# EAGLE design tracking_system (EAGLE 9.6.2)
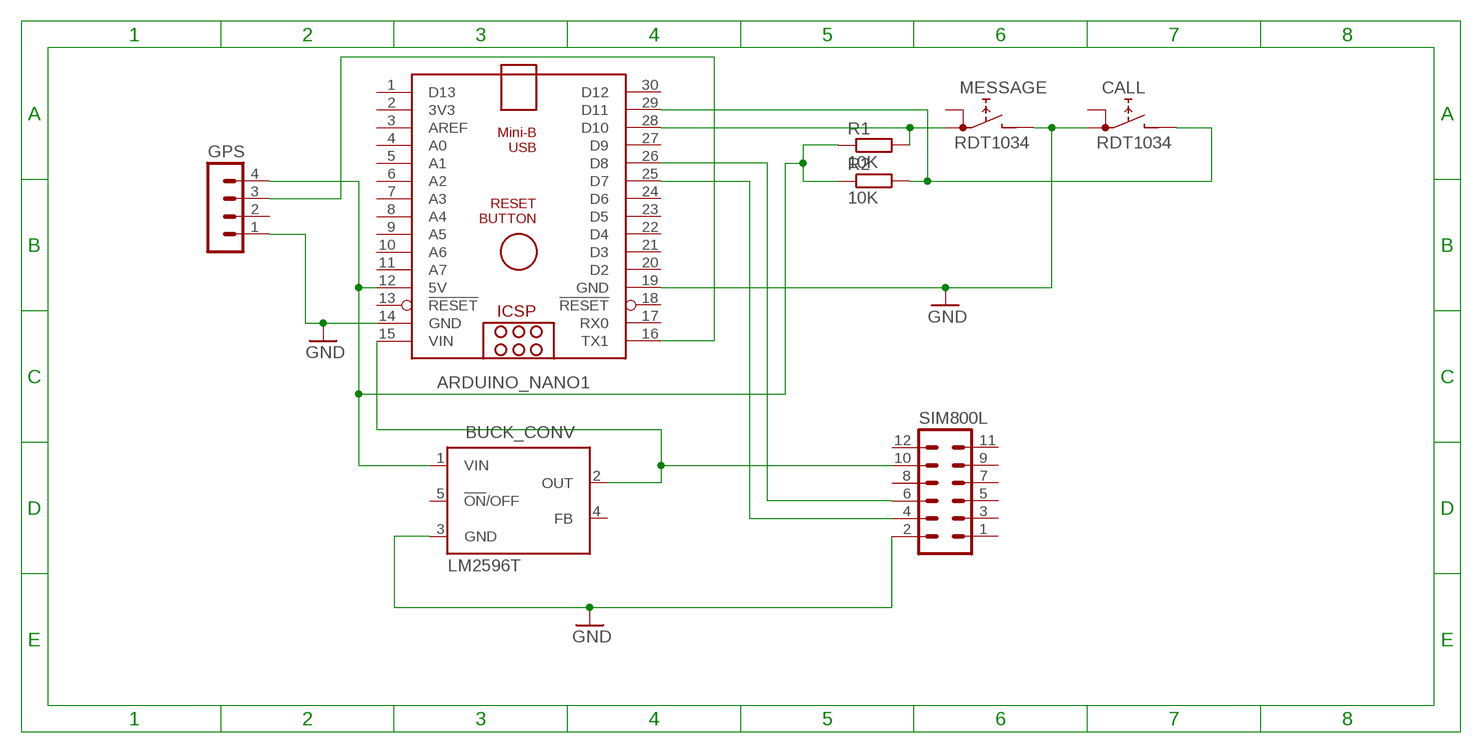
[diagram p0: schematic, sheet 1]

## Parts
ARDUINO_NANO1  ARDUINO_NANO  [ARDUINO_NANO]
BUCK_CONV  LM2596T  [T05D]
CALL  RDT1034  [RDT1034]
GPS  MA04-1  [MA04-1]
MESSAGE  RDT1034  [RDT1034]
R1  10K  R-EU_0207/10  [0207/10]
R2  10K  R-EU_0207/10  [0207/10]
SIM800L  MA06-2  [MA06-2]

## Nets
GND: ARDUINO_NANO1.14(GND) ARDUINO_NANO1.19(GND) BUCK_CONV.3(GND) CALL.A1 GPS.1 MESSAGE.B SIM800L.2
N$2: ARDUINO_NANO1.16(TX1) GPS.3
N$3: ARDUINO_NANO1.12(5V) BUCK_CONV.1(VIN) GPS.4 R1.1 R2.1
N$4: ARDUINO_NANO1.28(D10) MESSAGE.A1 R1.2
N$5: ARDUINO_NANO1.25(D7) SIM800L.4
N$7: ARDUINO_NANO1.29(D11) CALL.B R2.2
N$8: ARDUINO_NANO1.26(D8) SIM800L.6
N$9: ARDUINO_NANO1.15(VIN) BUCK_CONV.2(OUT) SIM800L.10
Unconnected: ARDUINO_NANO1.1(D13) ARDUINO_NANO1.2(3V3) ARDUINO_NANO1.3(AREF) ARDUINO_NANO1.4(A0) ARDUINO_NANO1.5(A1) ARDUINO_NANO1.6(A2) ARDUINO_NANO1.7(A3) ARDUINO_NANO1.8(A4) ARDUINO_NANO1.9(A5) ARDUINO_NANO1.10(A6) ARDUINO_NANO1.11(A7) ARDUINO_NANO1.13(!RESET) ARDUINO_NANO1.17(RX0) ARDUINO_NANO1.18(!RESET) ARDUINO_NANO1.20(D2) ARDUINO_NANO1.21(D3) ARDUINO_NANO1.22(D4) ARDUINO_NANO1.23(D5) ARDUINO_NANO1.24(D6) ARDUINO_NANO1.27(D9) ARDUINO_NANO1.30(D12) BUCK_CONV.4(FB) BUCK_CONV.5(!ON!/OFF) CALL.A GPS.2 MESSAGE.A SIM800L.1 SIM800L.3 SIM800L.5 SIM800L.7 SIM800L.8 SIM800L.9 SIM800L.11 SIM800L.12

## Library data of the parts
ARDUINO_NANO1 = ArduinoNanoV30:ARDUINO_NANO: Arduino Nano V3.0 Overview: The Arduino Nano is a small, complete, and breadboard-friendly board based on the ATmega328 (Arduino Nano 3.x) or ATmega168 (Arduino Nano 2.x). It has more or less the same functionality of the Arduino Duemilanove, but in a different package. It lacks only a DC power jack, and works with a Mini-B USB cable instead of a standard one. The Nano was designed and is being produced by Gravitech. Specifications: Microcontroller Atmel ATmega168 or ATmega328 Operating Voltage (logic level) 5 V Input Voltage (recommended) 7-12 V Input Voltage (limits) 6-20 V Digital I/O Pins 14 (of which 6 provide PWM output) Analog Input Pins 8 DC Current per I/O Pin 40 mA Flash Memory 16 KB (ATmega168) or 32 KB (ATmega328) of which 2 KB used by bootloader SRAM 1 KB (ATmega168) or 2 KB (ATmega328) EEPROM 512 bytes (ATmega168) or 1 KB (ATmega328) Clock Speed 16 MHz Dimensions 0.73" x 1.70" Length 45 mm Width 18 mm Weigth 5 g Power: The Arduino Nano can be powered via the Mini-B USB connection, 6-20V unregulated external power supply (pin 30), or 5V regulated external power supply (pin 27). The power source is automatically selected to the highest voltage source. Memory: The ATmega168 has 16 KB of flash memory for storing code (of which 2 KB is used for the bootloader); the ATmega328 has 32 KB, (also with 2 KB used for the bootloader). The ATmega168 has 1 KB of SRAM and 512 bytes of EEPROM (which can be read and written with the EEPROM library); the ATmega328 has 2 KB of SRAM and 1 KB of EEPROM. Input and Output: Each of the 14 digital pins on the Nano can be used as an input or output, using pinMode(), digitalWrite(), and digitalRead() functions. They operate at 5 volts. Each pin can provide or receive a maximum of 40 mA and has an internal pull-up resistor (disconnected by default) of 20-50 kOhms. In addition, some pins have specialized functions. Visit Arduino - ArduinoBoardNano <https://www.arduino.cc/en/Main/ArduinoBoardNano>
BUCK_CONV = national-semiconductor:LM2596: SIMPLE SWITCHER® Power Converter 150 kHz 3A Step-Down Voltage Regulator Source: http://www.national.com/ds/LM/LM2596.pdf; MPN: LM2596T-ADJ/LF02; OC_FARNELL: 9494162; OC_NEWARK: 65K5910
CALL MESSAGE = switch:RDT1034: PUSH SWITCH www.radiohm.com
GPS = con-lstb:MA04-1: PIN HEADER; OC_FARNELL: unknown; OC_NEWARK: unknown
R1 R2 = rcl:R-EU_: RESISTOR, European symbol; SPICEPREFIX: R
SIM800L = con-lstb:MA06-2: PIN HEADER; OC_FARNELL: unknown; OC_NEWARK: unknown

## Board
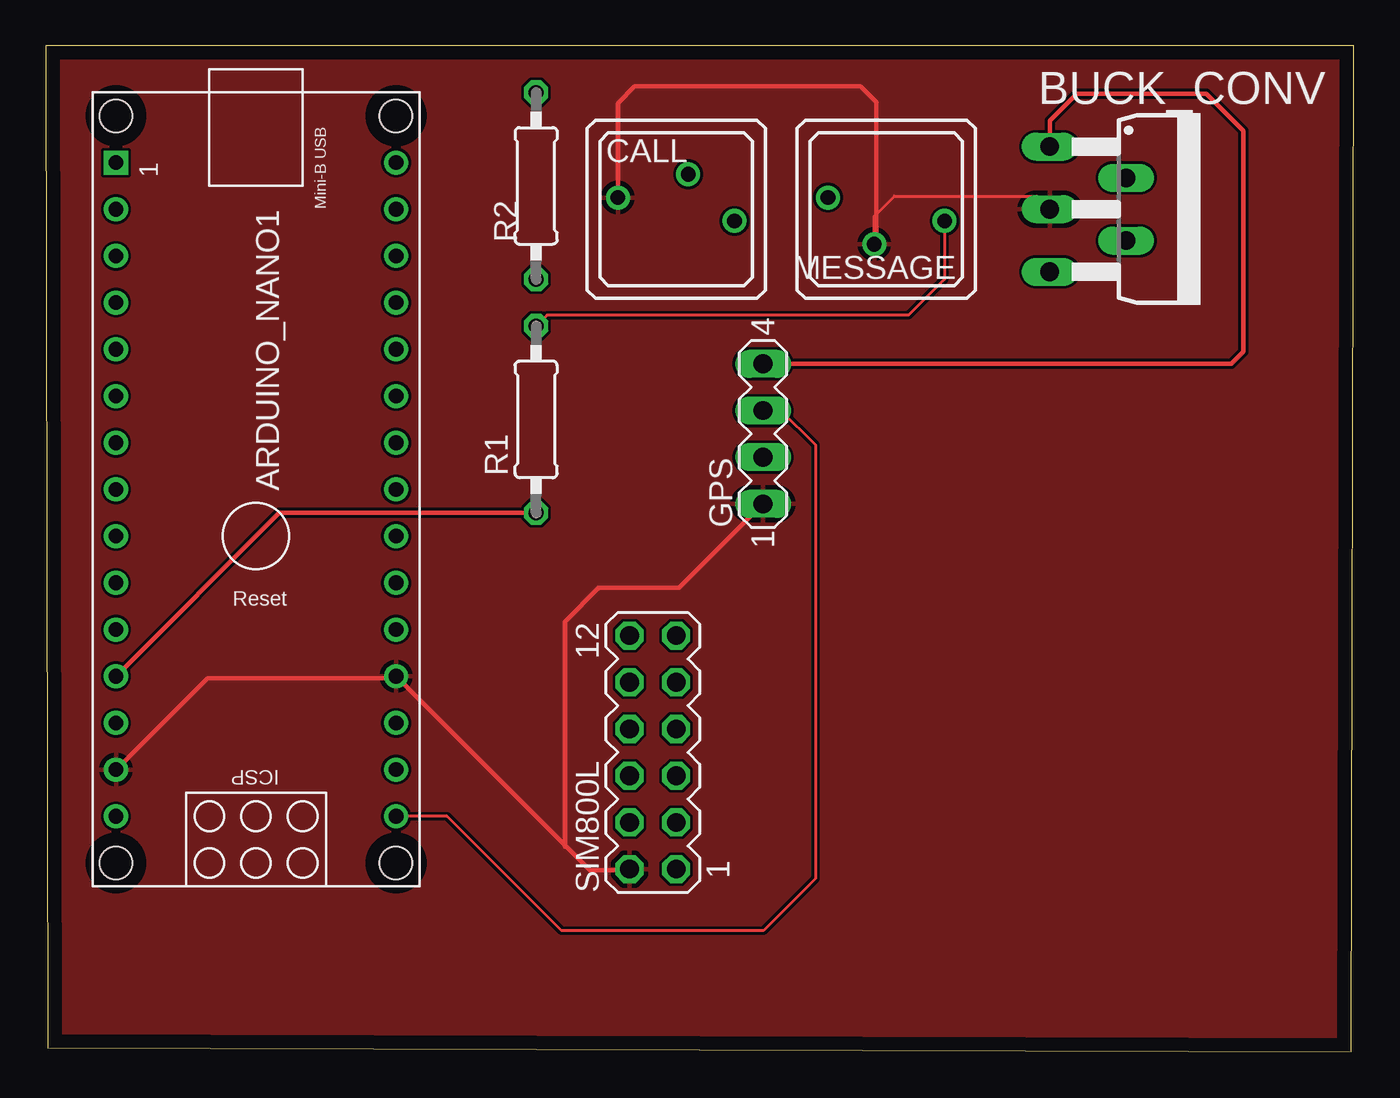
[diagram p1: board, top side]
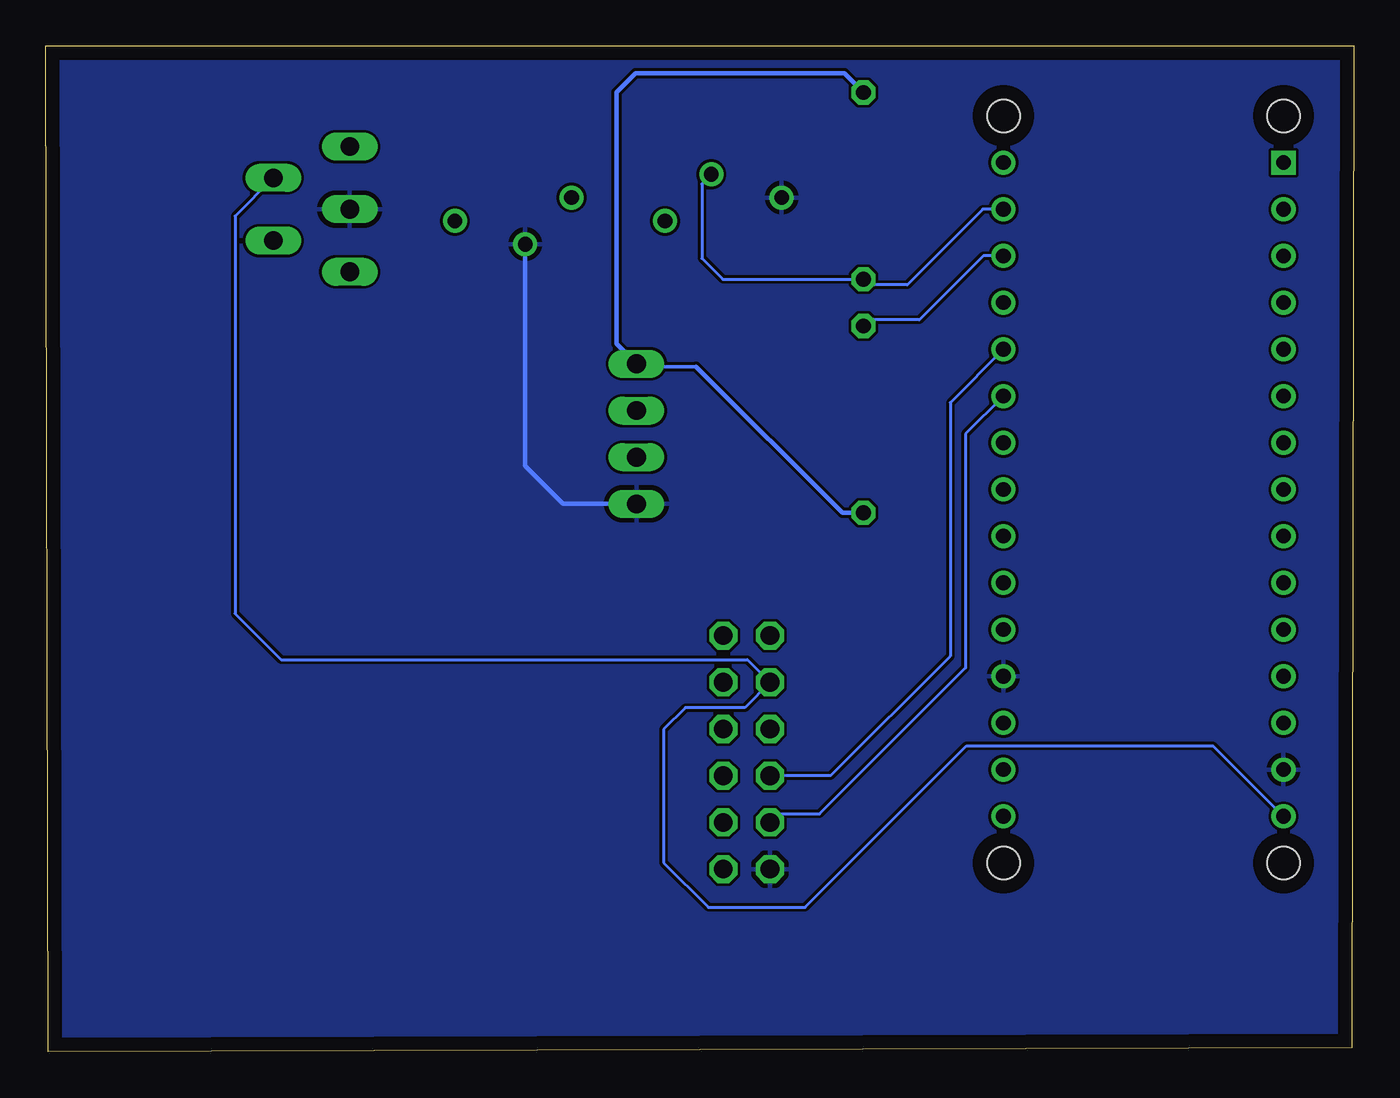
[diagram p2: board, bottom side, seen from below]

Size 71.15 x 54.7 mm. Coordinates in mm from the lower left corner, seen from the top.
Outline: 0.1,0.2 71.02,0 71.15,54.7 0,54.7 0.1,0.2
Copper layers (1*16): Top 0.035mm / dielectric 1.5mm / Bottom 0.035mm
Design rules "default *": minimum track width 6mil, minimum drill 0.35mm, track to track 6mil, track to pad 6mil, pad to pad 6mil, via to via 6mil, smd to smd 6mil, copper to edge 30mil, drill to drill 6mil, minimum pad ring 10mil, minimum via ring 8mil, stop-mask expansion 4mil, vias tented up to drill 0mil, thermal gap 10mil

### Footprints (pad centres in the part's own frame; a part is rotated, then mirrored left to right if it is on the bottom)
ARDUINO_NANO = drill 0.8 square: 1 -20.32,-7.62 | drill 0.8: 2 -17.78,-7.62; 3 -15.24,-7.62; 4 -12.7,-7.62; 5 -10.16,-7.62; 6 -7.62,-7.62; 7 -5.08,-7.62; 8 -2.54,-7.62; 9 0,-7.62; 10 2.54,-7.62; 11 5.08,-7.62; 12 7.62,-7.62; 13 10.16,-7.62; 14 12.7,-7.62; 15 15.24,-7.62; 16 15.24,7.62; 17 12.7,7.62; 18 10.16,7.62; 19 7.62,7.62; 20 5.08,7.62; 21 2.54,7.62; 22 0,7.62; 23 -2.54,7.62; 24 -5.08,7.62; 25 -7.62,7.62; 26 -10.16,7.62; 27 -12.7,7.62; 28 -15.24,7.62; 29 -17.78,7.62; 30 -20.32,7.62 | hole 1.778: -22.86,-7.62; -22.86,7.62; 17.78,7.62; 17.78,-7.62
T05D = drill 1.016 long: 1 -3.404,-5.08; 2 -1.702,-0.914; 3 0,-5.08; 4 1.702,-0.914; 5 3.404,-5.08
RDT1034 = drill 0.8: A 3.175,-0.635; A1 -3.175,0.635; B 0.65,1.9
MA04-1 = drill 1.016 long: 1 -3.81,0; 2 -1.27,0; 3 1.27,0; 4 3.81,0
0207/10 = drill 0.813 octagon: 1 -5.08,0; 2 5.08,0
MA06-2 = drill 1.016 octagon: 1 -6.35,-1.27; 2 -6.35,1.27; 3 -3.81,-1.27; 4 -3.81,1.27; 5 -1.27,-1.27; 6 -1.27,1.27; 7 1.27,-1.27; 8 1.27,1.27; 9 3.81,-1.27; 10 3.81,1.27; 11 6.35,-1.27; 12 6.35,1.27

### Placement (x,y rotation side)
ARDUINO_NANO1  11.43,28.04 270 top
BUCK_CONV  59.69,45.82 270 top
CALL  34.29,45.82 0 top
GPS  39.01,33.6 90 top
MESSAGE  45.72,45.82 180 top
R1  26.67,34.39 90 top
R2  26.67,47.09 270 top
SIM800L  33.02,16.28 90 top

### Tracks (layer width: path | path; a pad name or v marks a point on that pad's centre or on a via)
GND
  Top 0.152: 45.19,44.04 MESSAGE.B 45.07,45.45 46.15,46.53 53.9,46.53 BUCK_CONV.3 | 28.25,11.15 29.52,9.88 29.59,9.88 | 31.7,9.88 SIM800L.2 | ARDUINO_NANO1.19 19.15,20.32
  Top 0.254: CALL.A1 31.11,51.59 32.03,52.5 44.32,52.5 45.19,51.64 45.19,44.04 | GPS.1 34.44,25.22 30.07,25.22 28.25,23.39 28.25,11.15 | 31.7,9.88 29.59,9.88 19.15,20.32 8.79,20.32 ARDUINO_NANO1.14
  Bottom 0.254: GPS.1 43,29.79 45.07,31.86 MESSAGE.B
  pour Bottom: 0,54.69 0,0.2 71.04,0.2 71.04,54.66 0.03,54.66
  pour Top: 0,54.69 0,0.2 70.99,0.2 70.99,54.69
N$2
  Top 0.152: GPS.3 40.01,34.87 41.86,33.02 41.86,9.4 39.04,6.58 28.04,6.58 21.82,12.8 ARDUINO_NANO1.16
N$3
  Top 0.254: ARDUINO_NANO1.12 12.7,29.31 R1.1 | GPS.4 64.49,37.41 65.15,38.07 65.15,50.09 63.14,52.1 56.08,52.1 54.61,50.62 BUCK_CONV.1
  Bottom 0.152: 39.08,37.48 GPS.4
  Bottom 0.203: 35.76,37.26 38.86,37.26 GPS.4
  Bottom 0.254: R1.1 27.81,29.31 35.76,37.26 | R2.1 27.71,53.21 39.06,53.21 40.11,52.17 40.11,38.51 39.08,37.48
N$4
  Top 0.152: MESSAGE.A1 48.9,42.01 46.94,40.06 27.25,40.06 R1.2
  Bottom 0.152: ARDUINO_NANO1.28 20.14,43.28 23.62,39.8 26.34,39.8 R1.2
N$5
  Bottom 0.152: ARDUINO_NANO1.25 21.11,33.6 21.11,20.88 29.06,12.93 31.29,12.93 SIM800L.4
N$7
  Bottom 0.152: ARDUINO_NANO1.29 20.17,45.82 24.28,41.71 26.36,41.71 R2.2 34.31,42.01 35.46,43.15 35.46,47.2 CALL.B
N$8
  Bottom 0.152: ARDUINO_NANO1.26 21.95,35.31 21.95,21.51 28.45,15.01 SIM800L.6
N$9
  Bottom 0.152: ARDUINO_NANO1.15 7.64,16.64 21.06,16.64 29.84,7.85 35.1,7.85 37.54,10.29 37.54,17.53 36.35,18.72 33.12,18.72 SIM800L.10 32.98,21.32 58.36,21.32 60.86,23.83 60.86,45.44 BUCK_CONV.2